# EAGLE schematic LoveMeter (EAGLE 7.5.0)
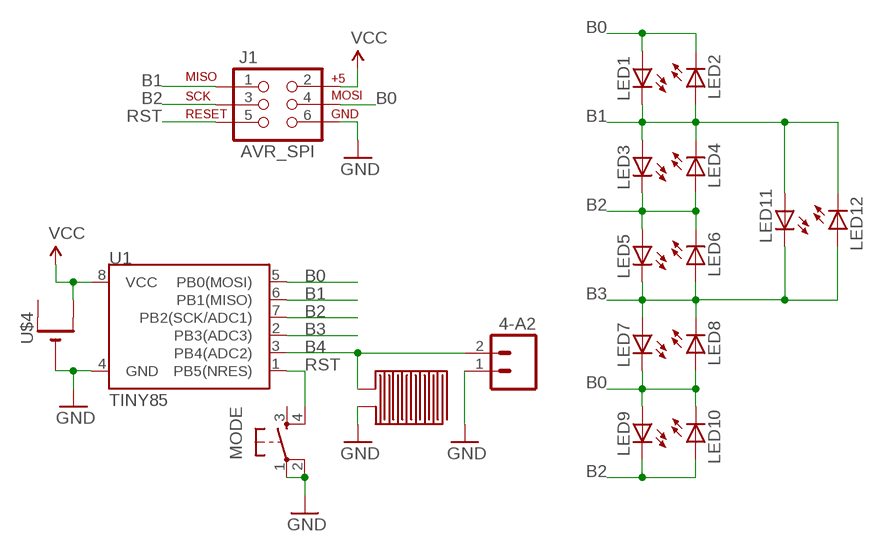
[diagram p0: schematic, sheet 1]

## Parts
4-A2  M02PTH  [1X02]
J1  AVR_SPI  AVR_SPI_PRG_6LABELED  [2X3-NS]
LED1  LEDOVAL  [LED-OVAL]
LED2  LEDOVAL  [LED-OVAL]
LED3  LEDOVAL  [LED-OVAL]
LED4  LEDOVAL  [LED-OVAL]
LED5  LEDOVAL  [LED-OVAL]
LED6  LEDOVAL  [LED-OVAL]
LED7  LEDOVAL  [LED-OVAL]
LED8  LEDOVAL  [LED-OVAL]
LED9  LEDOVAL  [LED-OVAL]
LED10  LEDOVAL  [LED-OVAL]
LED11  LEDOVAL  [LED-OVAL]
LED12  LEDOVAL  [LED-OVAL]
MODE  TAC_SWITCHPTH  [TACTILE-PTH]
U1  TINY85  ATTINY45TINY85-20-DIP  [DIP08]
U$3  THUMB_PAD  [THUMB_PAD]
U$4  CR2032STRAP  [CR2032_STRAP]

## Nets
B0: J1.4(MOSI) LED1.ANODE(A) LED2.CATHODE(C) LED7.CATHODE(C) LED8.ANODE(A) LED9.ANODE(A) LED10.CATHODE(C) U1.5(PB0(MOSI))
B1: J1.1(MISO) LED1.CATHODE(C) LED2.ANODE(A) LED3.ANODE(A) LED4.CATHODE(C) LED11.ANODE(A) LED12.CATHODE(C) U1.6(PB1(MISO))
B2: J1.3(SCK) LED3.CATHODE(C) LED4.ANODE(A) LED5.ANODE(A) LED6.CATHODE(C) LED9.CATHODE(C) LED10.ANODE(A) U1.7(PB2(SCK/ADC1))
B3: LED5.CATHODE(C) LED6.ANODE(A) LED7.ANODE(A) LED8.CATHODE(C) LED11.CATHODE(C) LED12.ANODE(A) U1.2(PB3(ADC3))
B4: 4-A2.2 U1.3(PB4(ADC2)) U$3.2
GND: 4-A2.1 J1.6(GND) MODE.1 MODE.2 U1.4(GND) U$3.1 U$4.-
RST: J1.5(RST) MODE.4 U1.1(PB5(NRES))
VCC: J1.2(V+) U1.8(VCC) U$4.+2(+1)
Unconnected: MODE.3 U$4.+

## Library data of the parts
4-A2 = SparkFun-Connectors:M02: Standard 2-pin 0.1" header. Use with - straight break away headers ( PRT-00116) - right angle break away headers (PRT-00553) - swiss pins (PRT-00743) - machine pins (PRT-00117) - female headers (PRT-00115) Molex polarized connector foot print use with: PRT-08233 with associated crimp pins and housings. 2.54_SCREWTERM for use with PRT-10571. 3.5mm Screw Terminal footprints for PRT-08084 5mm Screw Terminal footprints for use with PRT-08432
J1 = barbary_enterprises:AVR_SPI_PRG_6: AVR ISP 6 Pin This is the reduced ISP connector for AVR programming. Common on Arduino. This footprint will take up less PCB space and can be used with a 10-pin to 6-pin adapter such as SKU: BOB-08508
LED1-LED12 = barbary_enterprises:LED: LEDs Standard schematic elements and footprints for 5mm, 3mm, 1206, and 0603 sized LEDs. 5mm - Spark Fun Electronics SKU : COM-00529 (and others)
MODE = barbary_enterprises:TAC_SWITCH: Momentary Switch Button commonly used for reset or general input. Spark Fun Electronics SKU : COM-00097 SMT- SWCH-08247
U1 = SparkFun-DigitalIC:ATTINY45: Atmel 8-pin 2/4/8kB flash uC; PROD_ID: IC-09445; VALUE: TINY85-20-DIP
U$3 = ThumbPad:THUMB_PAD
U$4 = battery:CR2032